# EAGLE design board_PMA (EAGLE 9.6.2)
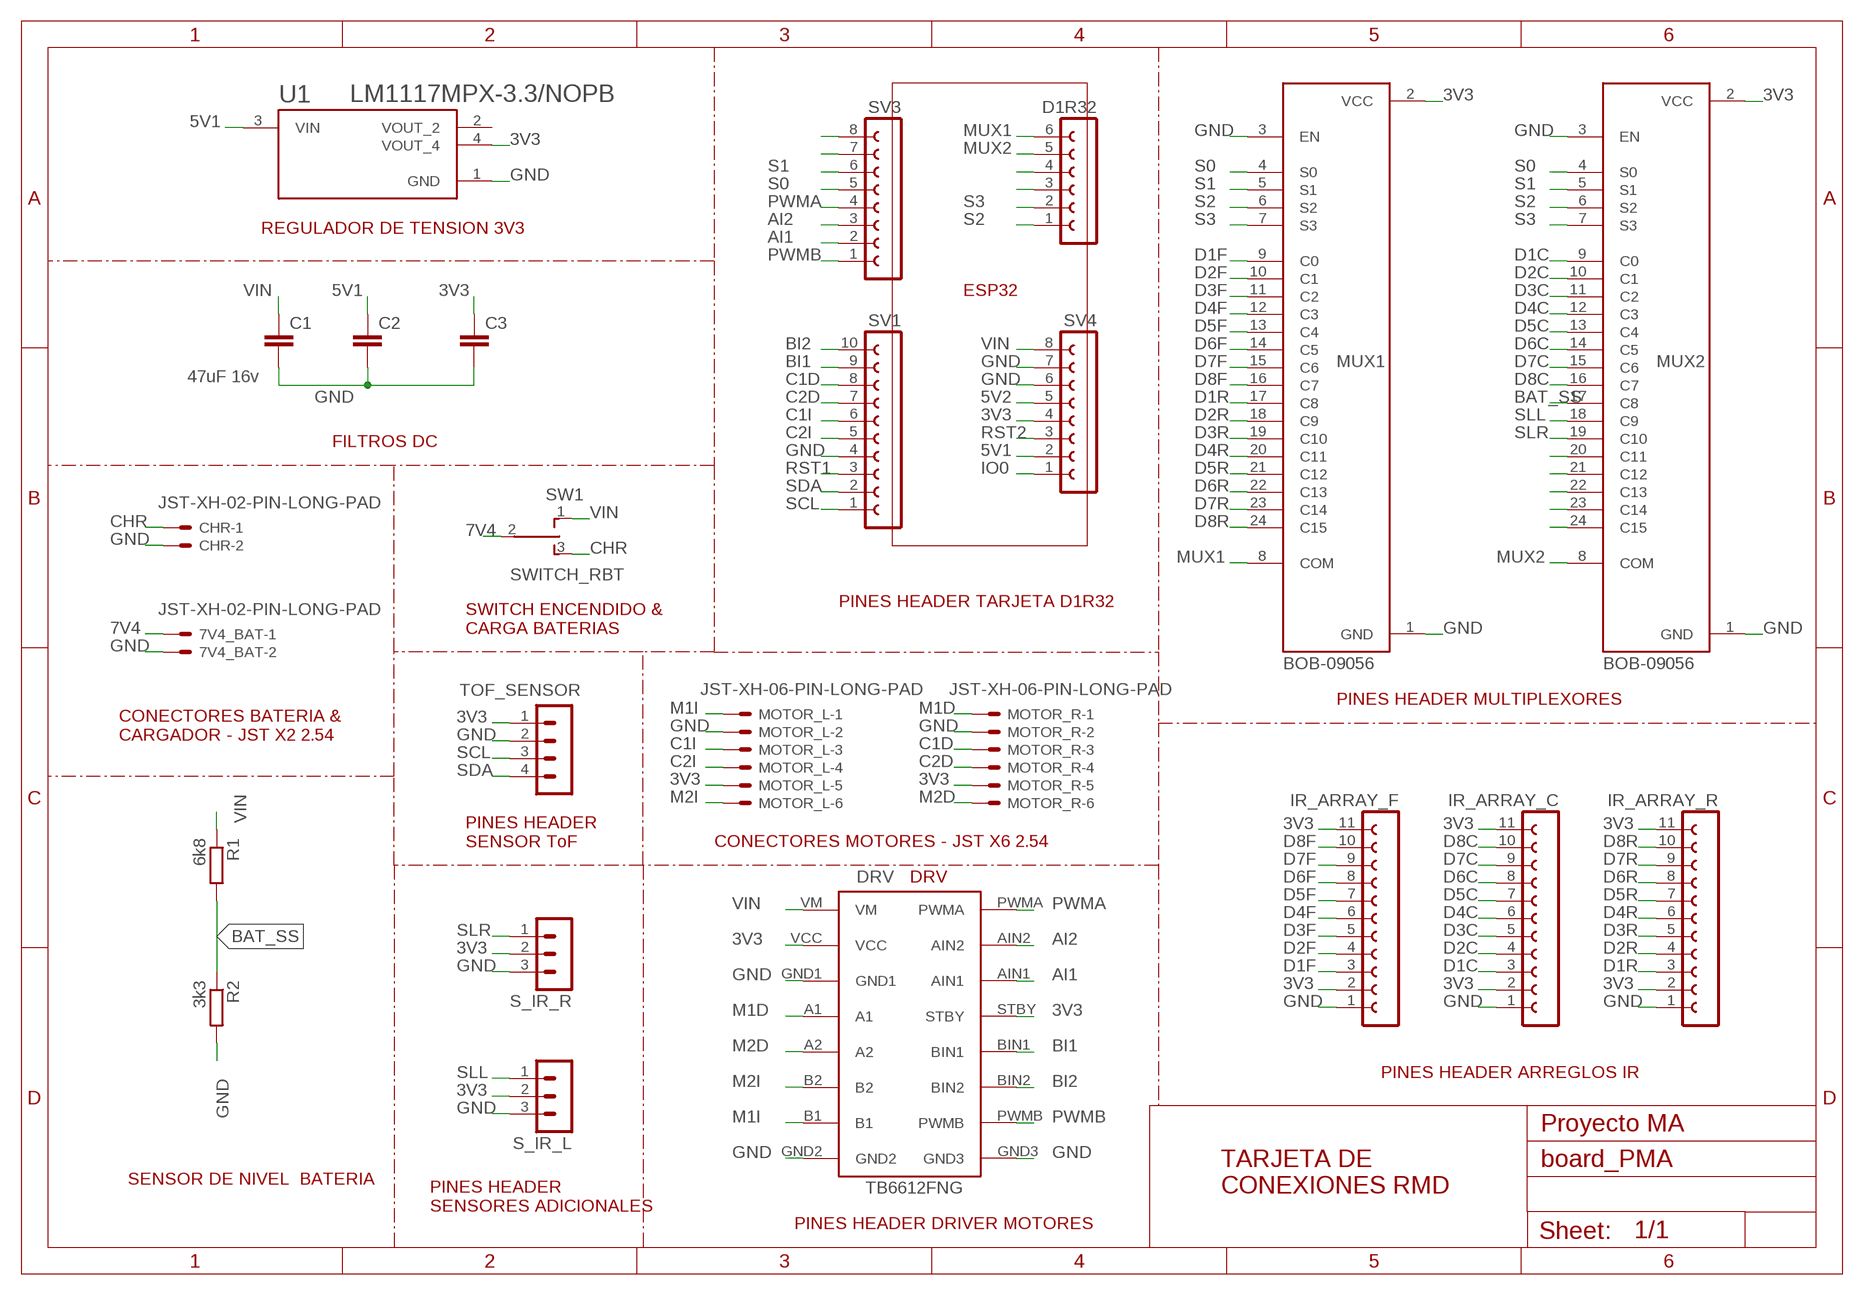
[diagram p0: schematic, sheet 1]

## Parts
7V4_BAT  JST-XH-02-PIN-LONG-PAD  [JST-XH-02-PACKAGE-LONG-PAD]
C1  47uF 16v  C-EUC1206K  [C1206K]
C2  C-EUC1206K  [C1206K]
C3  C-EUC1206K  [C1206K]
CHR  JST-XH-02-PIN-LONG-PAD  [JST-XH-02-PACKAGE-LONG-PAD]
D1R32  FE06-1  [FE06]
DRV  TB6612FNG  [TB6612FNG]
IR_ARRAY_C  FE11-1  [FE11]
IR_ARRAY_F  FE11-1  [FE11]
IR_ARRAY_R  FE11-1  [FE11]
MOTOR_L  JST-XH-06-PIN-LONG-PAD  [JST-XH-06-PACKAGE-LONG-PAD]
MOTOR_R  JST-XH-06-PIN-LONG-PAD  [JST-XH-06-PACKAGE-LONG-PAD]
MUX1  BOB-09056  [XDCR_BOB-09056]
MUX2  BOB-09056  [XDCR_BOB-09056]
R1  6k8  R-EU_0207/10  [0207/10]
R2  3k3  R-EU_0207/10  [0207/10]
S_IR_L  MA03-1  [MA03-1]
S_IR_R  MA03-1  [MA03-1]
SV1  FE10-1  [FE10]
SV3  FE08-1  [FE08]
SV4  FE08-1  [FE08]
SW1  SWITCH_RBT  [SW]
TOF_SENSOR  MA04-1  [MA04-1]
U1  LM1117MPX-3.3/NOPB  [VREG_LM1117MPX-3.3/NOPB]

## Nets
3V3: C3.1 DRV.STBY DRV.VCC IR_ARRAY_C.2 IR_ARRAY_C.11 IR_ARRAY_F.2 IR_ARRAY_F.11 IR_ARRAY_R.2 IR_ARRAY_R.11 MOTOR_L.5 MOTOR_R.5 MUX1.2(VCC) MUX2.2(VCC) S_IR_L.2 S_IR_R.2 SV4.4 TOF_SENSOR.1 U1.4(VOUT_4)
5V1: C2.1 SV4.2 U1.3(VIN)
5V2: SV4.5
7V4: 7V4_BAT.1 SW1.2
AI1: DRV.AIN1 SV3.2
AI2: DRV.AIN2 SV3.3
BAT_SS: MUX2.17(C8) R1.2 R2.1
BI1: DRV.BIN1 SV1.9
BI2: DRV.BIN2 SV1.10
C1D: MOTOR_R.3 SV1.8
C1I: MOTOR_L.3 SV1.6
C2D: MOTOR_R.4 SV1.7
C2I: MOTOR_L.4 SV1.5
CHR: CHR.1 SW1.3
D1C: IR_ARRAY_C.3 MUX2.9(C0)
D1F: IR_ARRAY_F.3 MUX1.9(C0)
D1R: IR_ARRAY_R.3 MUX1.17(C8)
D2C: IR_ARRAY_C.4 MUX2.10(C1)
D2F: IR_ARRAY_F.4 MUX1.10(C1)
D2R: IR_ARRAY_R.4 MUX1.18(C9)
D3C: IR_ARRAY_C.5 MUX2.11(C2)
D3F: IR_ARRAY_F.5 MUX1.11(C2)
D3R: IR_ARRAY_R.5 MUX1.19(C10)
D4C: IR_ARRAY_C.6 MUX2.12(C3)
D4F: IR_ARRAY_F.6 MUX1.12(C3)
D4R: IR_ARRAY_R.6 MUX1.20(C11)
D5C: IR_ARRAY_C.7 MUX2.13(C4)
D5F: IR_ARRAY_F.7 MUX1.13(C4)
D5R: IR_ARRAY_R.7 MUX1.21(C12)
D6C: IR_ARRAY_C.8 MUX2.14(C5)
D6F: IR_ARRAY_F.8 MUX1.14(C5)
D6R: IR_ARRAY_R.8 MUX1.22(C13)
D7C: IR_ARRAY_C.9 MUX2.15(C6)
D7F: IR_ARRAY_F.9 MUX1.15(C6)
D7R: IR_ARRAY_R.9 MUX1.23(C14)
D8C: IR_ARRAY_C.10 MUX2.16(C7)
D8F: IR_ARRAY_F.10 MUX1.16(C7)
D8R: IR_ARRAY_R.10 MUX1.24(C15)
GND: 7V4_BAT.2 C1.2 C2.2 C3.2 CHR.2 DRV.GND1 DRV.GND2 DRV.GND3 IR_ARRAY_C.1 IR_ARRAY_F.1 IR_ARRAY_R.1 MOTOR_L.2 MOTOR_R.2 MUX1.1(GND) MUX1.3(EN) MUX2.1(GND) MUX2.3(EN) R2.2 S_IR_L.3 S_IR_R.3 SV1.4 SV4.6 SV4.7 TOF_SENSOR.2 U1.1(GND)
IO0: SV4.1
M1D: DRV.A1 MOTOR_R.1
M1I: DRV.B1 MOTOR_L.1
M2D: DRV.A2 MOTOR_R.6
M2I: DRV.B2 MOTOR_L.6
MUX1: D1R32.6 MUX1.8(COM)
MUX2: D1R32.5 MUX2.8(COM)
N$1: D1R32.3
N$7: SV3.7
N$8: SV3.8
N$16: D1R32.4
N$32: MUX2.20(C11)
N$33: MUX2.21(C12)
N$34: MUX2.22(C13)
N$35: MUX2.23(C14)
N$36: MUX2.24(C15)
PWMA: DRV.PWMA SV3.4
PWMB: DRV.PWMB SV3.1
RST1: SV1.3
RST2: SV4.3
S0: MUX1.4(S0) MUX2.4(S0) SV3.5
S1: MUX1.5(S1) MUX2.5(S1) SV3.6
S2: D1R32.1 MUX1.6(S2) MUX2.6(S2)
S3: D1R32.2 MUX1.7(S3) MUX2.7(S3)
SCL: SV1.1 TOF_SENSOR.3
SDA: SV1.2 TOF_SENSOR.4
SLL: MUX2.18(C9) S_IR_L.1
SLR: MUX2.19(C10) S_IR_R.1
VIN: C1.1 DRV.VM R1.1 SV4.8 SW1.1
Unconnected: U1.2(VOUT_2)

## Notes on the sheet
- REGULADOR DE TENSION 3V3
- ESP32
- FILTROS DC
- PINES HEADER TARJETA D1R32
- SWITCH ENCENDIDO &
  CARGA BATERIAS
- PINES HEADER MULTIPLEXORES
- CONECTORES BATERIA &
  CARGADOR - JST X2 2.54
- PINES HEADER
  SENSOR ToF
- CONECTORES MOTORES - JST X6 2.54
- PINES HEADER ARREGLOS IR
- Proyecto MA
- SENSOR DE NIVEL  BATERIA
- TARJETA DE
  CONEXIONES RMD
- PINES HEADER
  SENSORES ADICIONALES
- PINES HEADER DRIVER MOTORES

## Library data of the parts
7V4_BAT CHR = plataformaEXP:JST-XH-02-PIN: JST XH Connector 2 Pin Wire to board connector. Pitch: 2,54 mm, (0.100") Number of pins: 2 Created by Rembrandt Electronics www.rembrandtelectronics.com
C1-C3 = plataformaEXP:C-EU: CAPACITOR, European symbol; SPICEPREFIX: C
D1R32 = plataformaEXP:FE06-1: FEMALE HEADER; OC_FARNELL: unknown; OC_NEWARK: unknown
DRV = plataformaEXP:TB6612FNG
IR_ARRAY_C IR_ARRAY_F IR_ARRAY_R = plataformaEXP:FE11-1: FEMALE HEADER; OC_FARNELL: unknown; OC_NEWARK: unknown
MOTOR_L MOTOR_R = plataformaEXP:JST-XH-06-PIN: JST XH Connector 2 Pin Wire to board connector. Pitch: 2,54 mm, (0.100") Number of pins: 6 Created by Rembrandt Electronics www.rembrandtelectronics.com
MUX1 MUX2 = plataformaEXP:BOB-09056: Switch Development Tools A/D MUX Breakout CD74HC4067 Check prices <https://pricing.snapeda.com/parts/BOB-09056/SparkFun%20Electronics/view-part?ref=eda>; AVAILABILITY: In Stock; DESCRIPTION: 74HC4067 Analog and Digital Switch Interface Evaluation Board; MF: SparkFun Electronics; MP: BOB-09056; PACKAGE: None; PRICE: None; PURCHASE-URL: https://pricing.snapeda.com/search/part/BOB-09056/?ref=eda
R1 R2 = plataformaEXP:R-EU_: RESISTOR, European symbol; SPICEPREFIX: R
S_IR_L S_IR_R = plataformaEXP:MA03-1: PIN HEADER; OC_FARNELL: unknown; OC_NEWARK: unknown
SV1 = plataformaEXP:FE10-1: FEMALE HEADER; OC_FARNELL: unknown; OC_NEWARK: unknown
SV3 SV4 = plataformaEXP:FE08-1: FEMALE HEADER; OC_FARNELL: unknown; OC_NEWARK: unknown
SW1 = plataformaEXP:SWITCH_RBT
TOF_SENSOR = plataformaEXP:MA04-1: PIN HEADER; OC_FARNELL: unknown; OC_NEWARK: unknown
U1 = plataformaEXP:LM1117MPX-3.3/NOPB: 800-mA 15-V linear voltage regulator 4-SOT-223 0 to 125 Check prices <https://pricing.snapeda.com/parts/LM1117MPX-3.3/NOPB/Texas%20Instruments/view-part?ref=eda>; AVAILABILITY: No availability data; DESCRIPTION: 800-mA 15-V linear voltage regulator 4-SOT-223 0 to 125; MF: Texas Instruments; MP: LM1117MPX-3.3/NOPB; PACKAGE: SOT-223-4 Texas Instruments; PRICE: None; PURCHASE-URL: https://pricing.snapeda.com/search/part/LM1117MPX-3.3/NOPB/?ref=eda

## Board
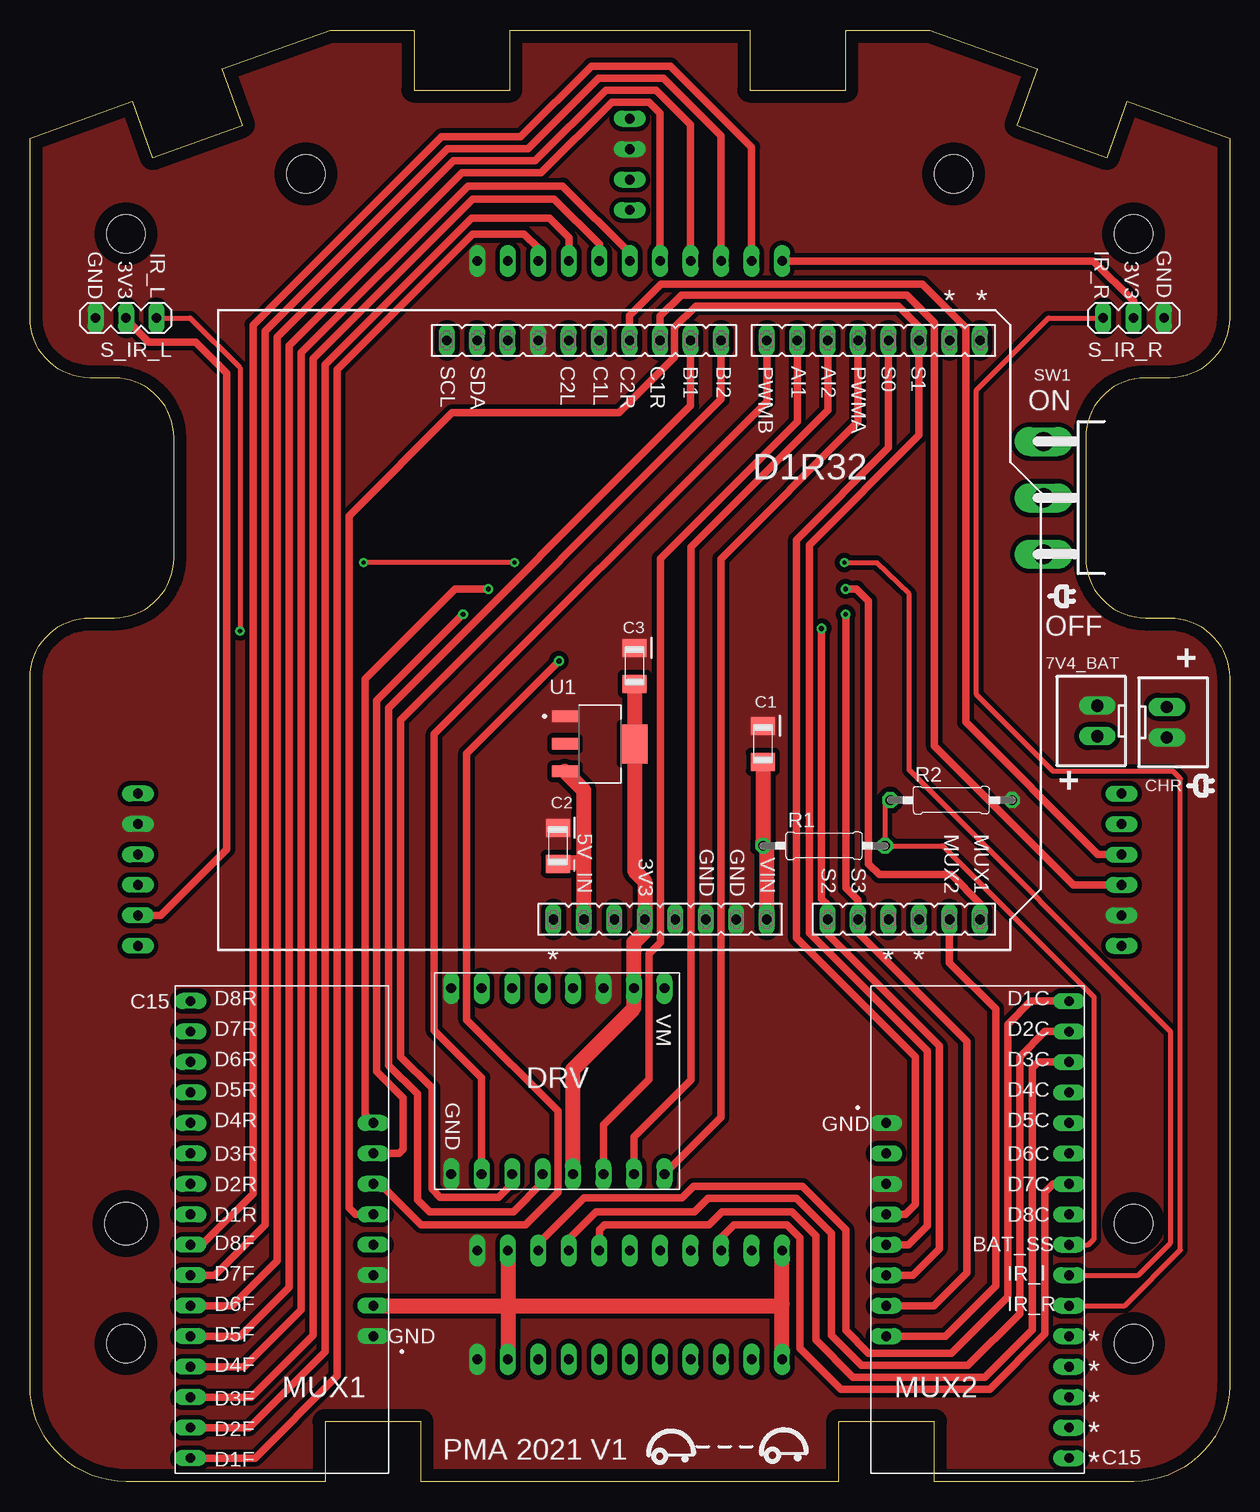
[diagram p1: board, top side]
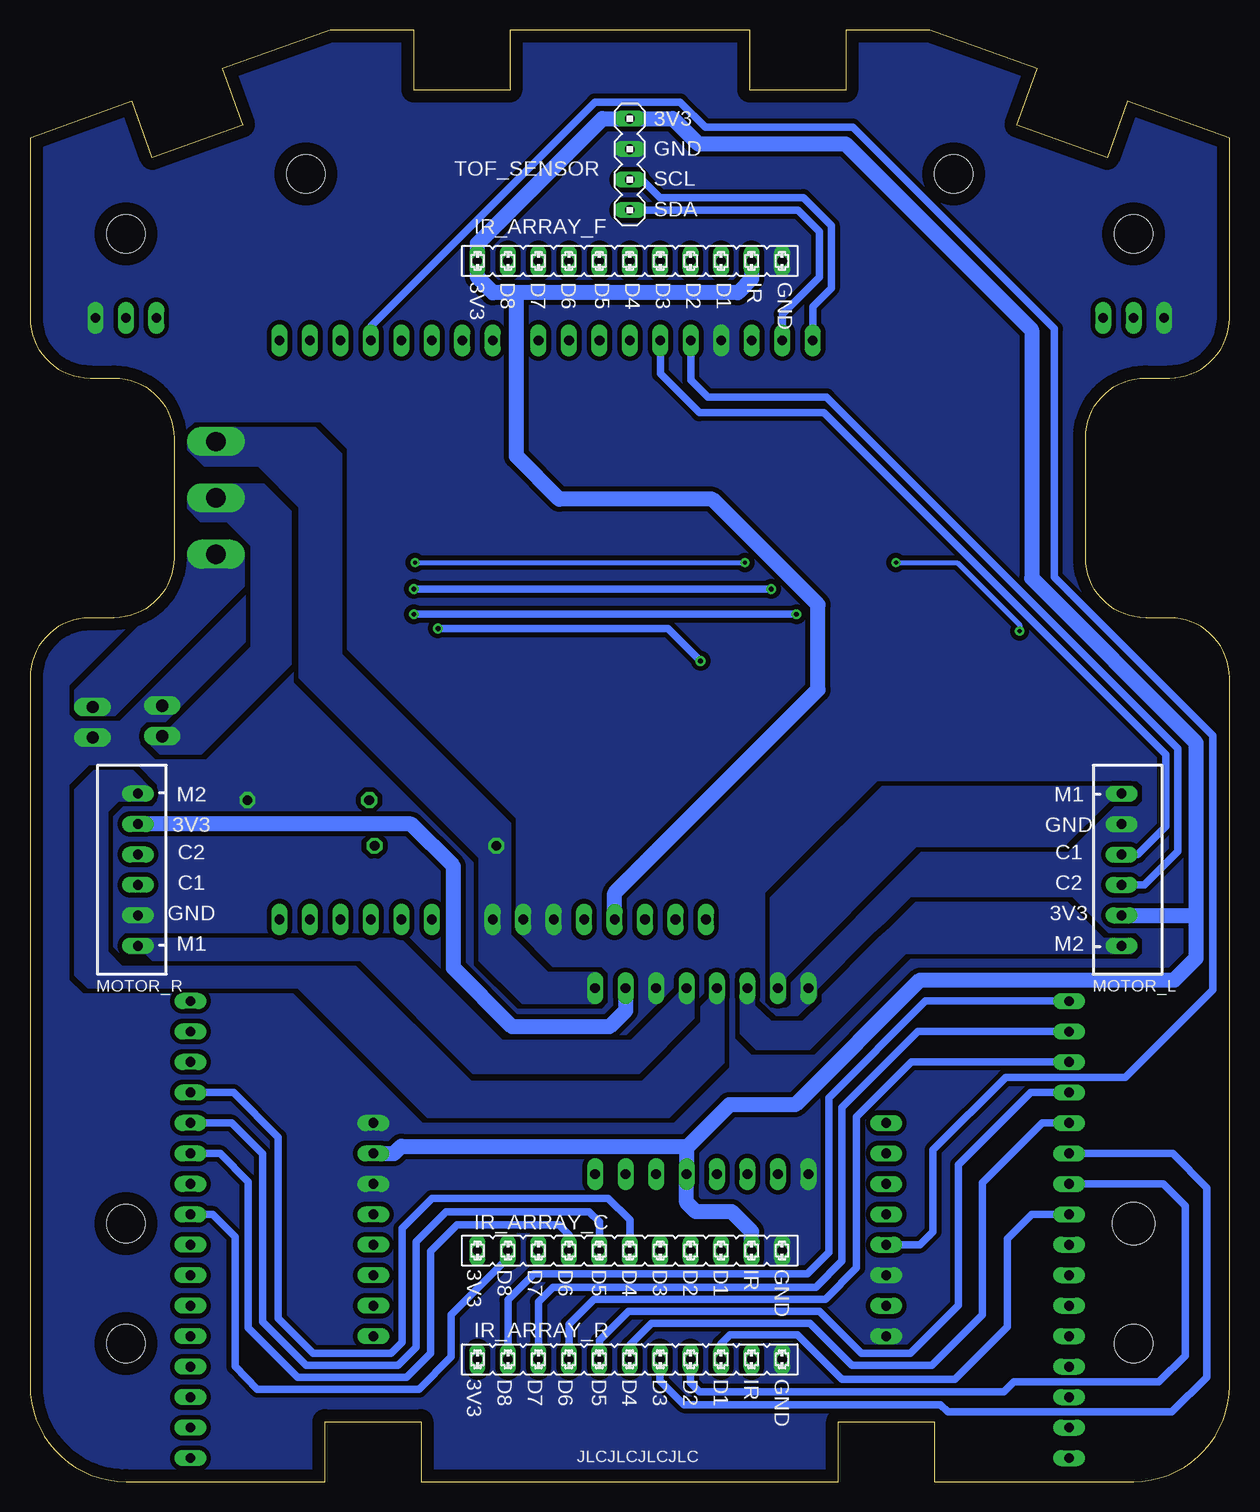
[diagram p2: board, bottom side, seen from below]

Size 100 x 121 mm. Coordinates in mm from the lower left corner, seen from the top.
Outline: 67.4,5 67.4,0 32.6,0 32.6,5 24.6,5 24.6,0 8,0 arc-90 0,8 0,67 arc-90 5,72 7,72 arc90 12,77 12,87 arc90 7,92 5,92 arc-90 0,97 0,112 8.51,115.06 10.2,110.36 17.73,113.07 16.04,117.77 25,121 32,121 32,116 40,116 40,121 50,121 60,121 60,116 68,116 68,121 75,121 83.97,117.77 82.27,113.07 89.8,110.36 91.49,115.06 100,112 100,97 arc-90 95,92 93,92 arc90 88,87 88,77 arc90 93,72 95,72 arc-90 100,67 100,8 arc-90 92,0 75.4,0 75.4,5 67.4,5
Copper layers (1*16): Top 0.035mm / dielectric 1.5mm / Bottom 0.035mm
Design rules "default": minimum track width 6mil, minimum drill 0.35mm, track to track 6mil, track to pad 6mil, pad to pad 6mil, via to via 6mil, smd to smd 6mil, copper to edge 40mil, drill to drill 6mil, minimum pad ring 10mil, minimum via ring 8mil, stop-mask expansion 4mil, vias tented up to drill 0mil, thermal gap 10mil
Holes 3.2 mm at 8,104 23,109 77,109 92,104 92,21.5 92,11.5 8,11.5
Holes 3.5 mm at 8,21.5

### Footprints (pad centres in the part's own frame; a part is rotated, then mirrored left to right if it is on the bottom)
JST-XH-02-PACKAGE-LONG-PAD = drill 1.016 long: 1 -1.27,0; 2 1.27,0
C1206K = smd 1.5 x 2: 1 -1.5,0; 2 1.5,0
FE06 = drill 0.813 long: 1 -6.35,0; 2 -3.81,0; 3 -1.27,0; 4 1.27,0; 5 3.81,0; 6 6.35,0
TB6612FNG = drill 0.813 long: A1 -7.62,1.27; A2 -7.62,-1.27; AIN1 7.874,3.81; AIN2 7.874,6.35; B1 -7.62,-6.35; B2 -7.62,-3.81; BIN1 7.874,-1.27; BIN2 7.874,-3.81; GND1 -7.62,3.81; GND2 -7.62,-8.89; GND3 7.874,-8.89; PWMA 7.874,8.89; PWMB 7.874,-6.35; STBY 7.874,1.27; VCC -7.62,6.35; VM -7.62,8.89
FE11 = drill 0.813 long: 1 -12.7,0; 2 -10.16,0; 3 -7.62,0; 4 -5.08,0; 5 -2.54,0; 6 0,0; 7 2.54,0; 8 5.08,0; 9 7.62,0; 10 10.16,0; 11 12.7,0
JST-XH-06-PACKAGE-LONG-PAD = drill 0.813 long: 1 -6.35,0; 2 -3.81,0; 3 -1.27,0; 4 1.27,0; 5 3.81,0; 6 6.35,0
XDCR_BOB-09056 = drill 0.813 long: 1 -7.62,8.89; 2 -7.62,6.35; 3 -7.62,3.81; 4 -7.62,1.27; 5 -7.62,-1.27; 6 -7.62,-3.81; 7 -7.62,-6.35; 8 -7.62,-8.89; 9 7.62,19.05; 10 7.62,16.51; 11 7.62,13.97; 12 7.62,11.43; 13 7.62,8.89; 14 7.62,6.35; 15 7.62,3.81; 16 7.62,1.27; 17 7.62,-1.27; 18 7.62,-3.81; 19 7.62,-6.35; 20 7.62,-8.89; 21 7.62,-11.43; 22 7.62,-13.97; 23 7.62,-16.51; 24 7.62,-19.05
0207/10 = drill 0.813 octagon: 1 -5.08,0; 2 5.08,0
MA03-1 = drill 0.813 long: 1 -2.54,0; 2 0,0; 3 2.54,0
FE10 = drill 0.813 long: 1 -11.43,0; 2 -8.89,0; 3 -6.35,0; 4 -3.81,0; 5 -1.27,0; 6 1.27,0; 7 3.81,0; 8 6.35,0; 9 8.89,0; 10 11.43,0
FE08 = drill 0.813 long: 1 -8.89,0; 2 -6.35,0; 3 -3.81,0; 4 -1.27,0; 5 1.27,0; 6 3.81,0; 7 6.35,0; 8 8.89,0
SW = drill 1.6 long: 1 -4.7,0; 2 0,0; 3 4.7,0
MA04-1 = drill 0.813 long: 1 -3.81,0; 2 -1.27,0; 3 1.27,0; 4 3.81,0
VREG_LM1117MPX-3.3/NOPB = smd 2.15 x 0.95: 1 -2.9,2.3; 2 -2.9,0; 3 -2.9,-2.3 | smd 2.15 x 3.25: 4 2.9,0

### Placement (x,y rotation side)
7V4_BAT  88.98,63.4 90 top
C1  61.1,61.5 90 top
C2  44,53 90 top
C3  50.4,68 90 top
CHR  94.78,63.3 270 top
D1R32  72.85,46.86 0 top
DRV  44,33.5 270 top
IR_ARRAY_C  50,19.25 0 top
IR_ARRAY_F  50,101.75 0 top
IR_ARRAY_R  50,10.18 0 top
MOTOR_L  9,51 270 bottom
MOTOR_R  91,51 90 bottom
MUX1  21,21 180 top
MUX2  79,21 0 top
R1  66.2,53 0 top
R2  76.8,56.8 0 top
S_IR_L  8,97 180 top
S_IR_R  92,97 0 top
SV1  46.18,95.12 0 top
SV3  70.31,95.12 0 top
SV4  52.53,46.86 0 top
SW1  84.5,82 270 top
TOF_SENSOR  50,109.8 270 top
U1  47.5,61.5 0 top

### Tracks (layer width: path | path; a pad name or v marks a point on that pad's centre or on a via)
3V3
  Top 0.61: MOTOR_L.5 10.89,47.19 16.4,52.7 16.4,92.4 13.8,95 9.9,95 8,96.9 S_IR_L.2 | IR_ARRAY_F.11 88.65,101.75 92,98.4 S_IR_R.2
  Top 1.27: IR_ARRAY_R.11 62.7,14.8 | 62.7,14.8 IR_ARRAY_C.11 | IR_ARRAY_C.2 39.84,14.6 | 39.84,14.6 IR_ARRAY_R.2 | MUX1.2 39.79,14.65 | 39.79,14.65 39.84,14.6 | 39.79,14.65 62.55,14.65 62.7,14.8 | C3.1 U1.4 50.4,50.9 51.26,50.04 SV4.4 51.26,45.86 50.35,44.95 DRV.VCC 50.35,39.45 45.27,34.37 DRV.STBY
  Bottom 1.27: IR_ARRAY_C.2 39.84,20.84 41.5,22.5 44.5,22.5 45.27,23.27 DRV.STBY 45.27,27.83 | 70.8,27.35 MUX2.2 69.65,27.35 69.05,27.95 45.27,27.95 45.27,27.83 | IR_ARRAY_F.2 39.84,100.26 41,99.1 59.46,99.1 | 59.46,99.1 61.4,99.1 62.7,100.4 IR_ARRAY_F.11 62.7,103.2 52.29,113.61 TOF_SENSOR.1 46.4,113.61 44.3,111.51 32.01,111.51 16.5,96 16.5,75.3 2.8,61.6 2.8,46.9 | 45.27,27.83 41.7,31.4 36.2,31.4 25.8,41.8 4.6,41.8 2.8,43.6 2.8,46.9 | MOTOR_L.5 3.09,47.19 2.8,46.9 | DRV.VCC 50.35,39.25 51.7,37.9 59.8,37.9 64.7,42.8 64.7,51.3 68.21,54.81 MOTOR_R.5 | 59.46,99.1 59.46,85.46 55.89,81.89 43.11,81.89 34.31,73.09 34.31,66.01 51.26,49.06 SV4.4
5V1
  Top 1.27: SV4.2 46.18,51.6 | 46.18,51.6 46.18,57.62 U1.3 | C2.1 44.1,51.6 46.18,51.6
7V4
  pour Bottom (no thermals): 85.9,83.2 80.5,83.2 78.2,80.9 78.2,68.1 85.7,60.6 89.2,60.6 90.4,61.8 90.4,62.4 89.9,62.9 88.3,62.9 81.6,69.6 81.6,78 83.6,80 85.8,80 86.9,81.1 86.9,82.2
AI1
  Top 0.61: SV3.2 63.96,88.36 52.55,76.95 52.55,44.95 51.6,44 51.6,42.8 51.61,42.79 51.61,33.53 47.81,29.73 DRV.AIN1
AI2
  Top 0.61: DRV.AIN2 50.35,28.75 55.1,33.5 55.1,77.9 66.5,89.3 SV3.3
BAT_SS
  Top 0.406: MUX2.17 88.23,19.73 88.7,20.2 88.7,40.4 76.1,53 R1.2 71.28,56.36 R2.1
BI1
  Top 0.61: DRV.BIN1 42.73,24.93 40.3,22.5 33.3,22.5 32.3,23.5 32.3,32.3 29.9,34.7 29.9,64.5 55.07,89.67 SV1.9
BI2
  Top 0.61: DRV.BIN2 40.19,24.83 39.06,23.7 34.2,23.7 33.5,24.4 33.5,32.8 30.9,35.4 30.9,63.5 57.61,90.21 SV1.10
C1D
  Top 0.61: MOTOR_R.3 86.97,49.73 75.4,61.3 75.4,96.6 73.1,98.9 54.3,98.9 52.53,97.13 SV1.8
C1I
  Bottom 0.61: MOTOR_L.3 7.63,52.27 5.3,54.6 5.3,60.6 33.8,89.1 44.2,89.1 47.45,92.35 SV1.6
C2D
  Top 0.61: MOTOR_R.4 89.03,52.27 78,63.3 78,96.2 74.4,99.8 52.6,99.8 49.99,97.19 SV1.7
C2I
  Bottom 0.61: MOTOR_L.4 7.1,49.73 4.3,52.53 4.3,61.1 33.6,90.4 43.5,90.4 44.91,91.81 SV1.5
CHR
  pour Bottom (no thermals): 82.1,77.5 82.1,74.6 92.9,63.8 95.8,63.8 96.3,64.3 96.3,66 87.3,75 87.3,77.2 86,78.5 83.1,78.5
D1C
  Top 0.61: IR_ARRAY_C.3 42.38,19.85 46.18,23.65 54.35,23.65 55.3,24.6 64.4,24.6 68,21 68,12.6 69.9,10.7 76.8,10.7 81.5,15.4 81.5,38.1 83.45,40.05 MUX2.9
D1F
  Top 0.61: MUX1.9 18.75,1.95 25.6,8.8 25.6,92.7 36.9,104 41.2,104 42.38,102.82 IR_ARRAY_F.3
D1R
  Bottom 0.61: MUX1.17 16.48,22.27 18.54,20.21 18.54,12.88 22.88,8.54 32.32,8.54 36.02,12.24 41.66,12.24 42.4,11.5 42.4,10.2 IR_ARRAY_R.3
D2C
  Top 0.61: MUX2.10 84.61,37.51 82.5,35.4 82.5,14 78.2,9.7 69.3,9.7 66.8,12.2 66.8,20.7 63.9,23.6 56.5,23.6 55.4,22.5 47.2,22.5 44.92,20.22 IR_ARRAY_C.4
D2F
  Top 0.61: IR_ARRAY_F.4 44.92,103.68 43.3,105.3 36.8,105.3 24.6,93.1 24.6,10.8 18.29,4.49 MUX1.10
D2R
  Bottom 0.61: IR_ARRAY_R.4 44.92,8.22 44.2,7.5 18.8,7.5 18,8.3 5.9,8.3 3.7,10.5 3.7,23 5.51,24.81 MUX1.18
D3C
  Top 0.61: IR_ARRAY_C.5 47.46,20.96 47.9,21.4 56.6,21.4 57.7,22.5 63.5,22.5 65.5,20.5 65.5,11.8 68.6,8.7 79.6,8.7 83.56,12.66 83.56,34.46 84.07,34.97 MUX2.11
D3F
  Top 0.61: IR_ARRAY_F.5 47.46,103.14 43.7,106.9 36.9,106.9 23.6,93.6 23.6,12.2 18.43,7.03 MUX1.11
D3R
  Bottom 0.61: IR_ARRAY_R.5 47.46,8.38 45.48,6.4 24.1,6.4 23.5,5.8 4.8,5.8 1.9,8.7 1.9,24.5 4.75,27.35 MUX1.19
D4C
  Bottom 0.61: MUX2.12 83.03,32.43 79.3,28.7 79.3,13.6 76.4,10.7 69.9,10.7 69,11.6 69,21.1 66.5,23.6 51.8,23.6 50,21.8 IR_ARRAY_C.6
D4F
  Top 0.61: IR_ARRAY_F.6 50,102.4 44.4,108 36.5,108 22.6,94.1 22.6,14.3 17.87,9.57 MUX1.12
D4R
  Bottom 0.61: MUX1.20 15.61,29.89 20.6,24.9 20.6,13.9 24.8,9.7 31.5,9.7 35,13.2 48.2,13.2 50,11.4 IR_ARRAY_R.6
D5C
  Bottom 0.61: IR_ARRAY_C.7 52.54,21.64 53.4,22.5 65.3,22.5 67.8,20 67.8,11.2 69.3,9.7 77,9.7 80.6,13.3 80.6,27.3 83.19,29.89 MUX2.13
D5F
  Top 0.61: IR_ARRAY_F.7 52.54,114.06 51.6,115 48.5,115 42.6,109.1 36,109.1 21.6,94.7 21.6,16.2 17.51,12.11 MUX1.13
D5R
  Bottom 0.61: MUX1.21 16.57,32.43 22.6,26.4 22.6,14.7 26.6,10.7 30.7,10.7 34.2,14.2 50.1,14.2 52.54,11.76 IR_ARRAY_R.7
D6C
  Bottom 0.61: IR_ARRAY_C.8 55.08,20.58 55.9,21.4 64.4,21.4 66.6,19.2 66.6,10.7 68.6,8.7 77.7,8.7 81.8,12.8 81.8,25 84.15,27.35 MUX2.14
D6F
  Top 0.61: IR_ARRAY_F.8 55.08,113.12 52.2,116 48,116 42.1,110.1 35.3,110.1 20.6,95.4 20.6,18.4 16.85,14.65 MUX1.14
D6R
  Bottom 0.61: IR_ARRAY_R.8 55.08,13.12 53,15.2 33.7,15.2 31.1,17.8 31.1,30.4 26.53,34.97 MUX1.22
D7C
  Top 0.61: MUX2.15 85.31,24.81 84.6,24.1 84.6,12.3 80,7.7 67.6,7.7 64.2,11.1 64.2,20.3 63.1,21.4 58.7,21.4 57.62,20.32 IR_ARRAY_C.9
D7F
  Top 0.61: IR_ARRAY_F.9 57.62,112.18 52.8,117 47.4,117 41.5,111.1 34.8,111.1 19.6,95.9 19.6,21.4 15.39,17.19 MUX1.15
D7R
  Bottom 0.61: IR_ARRAY_R.9 57.62,14.98 56.4,16.2 34.5,16.2 32.3,18.4 32.3,31.2 25.99,37.51 MUX1.23
D8C
  Bottom 0.61: IR_ARRAY_C.10 60.16,18.64 64.9,13.9 64.9,10.4 67.56,7.7 81.04,7.7 82.9,9.6 82.9,20.4 84.77,22.27 MUX2.16
D8F
  Top 0.61: IR_ARRAY_F.10 60.16,111.24 53.4,118 46.8,118 40.9,112.1 34.3,112.1 18.6,96.4 18.6,24 14.33,19.73 MUX1.16
D8R
  Bottom 0.61: IR_ARRAY_R.10 60.16,15.14 58,17.3 35.2,17.3 33.4,19.1 33.4,32 25.35,40.05 MUX1.24
GND
  pour Top (isolate 0.406, rank 2, no thermals): 0,67 0,8 arc90 8,0 24.6,0 24.6,5 32.6,5 32.6,0 67.4,0 67.4,5 75.4,5 75.4,0 92,0 arc90 100,8 100,67 arc90 95,72 93,72 arc-90 88,77 88,87 arc-90 93,92 95,92 arc90 100,97 100,112 91.49,115.06 89.8,110.36 82.27,113.07 83.97,117.77 75,121 68,121 68,116 60,116 60,121 50,121 40,121 40,116 32,116 32,121 25,121 16.03,117.77 17.73,113.07 10.2,110.36 8.51,115.06 0,112 0,97 arc90 5,92 7,92 arc-90 12,87 12,77 arc-90 7,72 5,72 arc90
  pour Bottom (isolate 0.406, rank 2, no thermals): 8,0 arc-90 0,8 0,67 arc-90 5,72 7,72 arc90 12,77 12,87 arc90 7,92 5,92 arc-90 0,97 0,112 8.51,115.06 10.2,110.36 17.73,113.07 16.03,117.77 25,121 32,121 32,116 40,116 40,121 50,121 60,121 60,116 68,116 68,121 75,121 83.97,117.77 82.27,113.07 89.8,110.36 91.49,115.06 100,112 100,97 arc-90 95,92 93,92 arc90 88,87 88,77 arc90 93,72 95,72 arc-90 100,67 100,8 arc-90 92,0 75.4,0 75.4,5 67.4,5 67.4,0 32.6,0 32.6,5 24.6,5 24.6,0
M1D
  pour Bottom (isolate 0.406, no thermals): 44.6,41.8 44.6,38.6 49.2,34 63.1,34 72.5,43.4 89.8,43.4 90.4,44 91.8,44 92.1,44.3 92.1,44.9 91.7,45.3 69.1,45.3 60.6,36.8 49.9,36.8 45.9,40.8 45.9,41.8 45.5,42.2 45,42.2
M1I
  pour Bottom (isolate 0.406, no thermals): 7.7,57.4 7.7,57.6 8.1,58 29,58 35.6,51.4 38.3,48.7 38.3,41.1 38.3,40.3 37.9,39.9 37.3,39.9 37.2,40 37,40.2 37,42 26.1,52.9 21,52.9 13.8,52.9 10,56.7 8.1,56.7 7.7,57.1
M2D
  pour Bottom (no thermals): 42.1,41.9 42.1,34.9 46.7,30.3 66.9,30.3 77.7,41.1 95.2,41.1 96.3,42.2 96.3,57.7 94.7,59.3 91.4,59.3 89.8,57.7 89.8,57.1 90.2,56.7 92.6,56.7 93.5,55.8 93.5,44.2 92.3,43 72.8,43 63.2,33.4 49,33.4 44.1,38.3 44.1,39.6 43.4,40.3 43.4,41.9 43,42.3 42.5,42.3
M2I
  pour Bottom (isolate 0.406, no thermals): 7.7,44.4 7.7,44.8 8.2,45.3 10.5,45.3 13.5,48.3 26.2,48.3 28.3,46.2 29.3,45.3 34,40.6 34,40 35.6,38.4 38.2,38.4 39.55,39.7 39.55,41.9 40,42.4 40.4,42.4 40.8,42 40.8,37.3 39.5,36 35,36 27,44 8.1,44
MUX1  (via drill 0.4)
  Top 0.61: MUX1.8 27.92,30.59 27.92,66.9 35.42,74.4 v38.2,74.4 | D1R32.6 79.2,48.2 76.8,50.6 70.8,50.6 69.9,51.5 69.9,73.4 68.9,74.4 v68,74.4
  Bottom 0.61: v68,74.4 v38.2,74.4
MUX2
  Top 0.61: MUX2.8 76.31,12.11 80.5,16.3 80.5,39.4 76.66,43.24 D1R32.5
PWMA
  Top 0.61: DRV.PWMA 57.6,30.34 57.6,76.9 69.04,88.34 SV3.4
PWMB
  Top 0.61: DRV.PWMB 37.65,33.65 33.7,37.6 33.7,62.3 61.42,90.02 SV3.1
S0
  Top 0.61: SV3.5 71.58,86.18 63.9,78.5 63.9,45.3 73.8,35.4 73.8,23.1 72.97,22.27 MUX2.4
  Bottom 0.61: MUX1.4 25.82,19.73 24.72,20.83 24.72,27.63 18.65,33.7 8.7,33.7 1.4,41 1.4,62.2 14.6,75.4 14.6,96.1 31.4,112.9 43.7,112.9 45.8,115 52.9,115 71.58,96.32 SV3.5
S1
  Top 0.61: MUX2.5 73.23,19.73 74.8,21.3 74.8,35.9 64.98,45.72 64.98,78.08 74.12,87.22 SV3.6 74.12,96.28 72.4,98 55.5,98 53.75,96.25 53.75,93.75 49.1,89.1 35.2,89.1 26.6,80.5 26.6,22.8 27.13,22.27 MUX1.5
S2  (via drill 0.4)
  Top 0.61: MUX2.6 73.59,17.19 75.8,19.4 75.8,36.3 66.5,45.6 D1R32.1 66.5,48.06 66,48.56 v65.99,71.11 | MUX1.6 29.19,24.81 32.6,21.4 41.3,21.4 44,24.1 44,30.9 36.4,38.5 36.4,60.7 v44.1,68.4 | v65.99,71.11
  Bottom 0.61: v65.99,71.11 v65.98,71.1 46.8,71.1 v44.1,68.4
S3  (via drill 0.4)
  Top 0.61: MUX2.7 75.35,14.65 78.1,17.4 78.1,36.7 69.04,45.76 D1R32.2 69.04,48.46 68.04,49.46 68.04,72.26 v68,72.3 | MUX1.7 30.75,27.35 31.1,27.7 31.1,32 28.9,34.2 28.9,65.1 v36.1,72.3
  Bottom 0.61: v68,72.3 v36.1,72.3
SCL
  Bottom 0.61: TOF_SENSOR.3 49,108.53 47.5,107.03 35.53,107.03 33.2,104.7 33.2,99.5 34.75,97.95 SV1.1
SDA
  Bottom 0.61: TOF_SENSOR.4 35.99,105.99 34.2,104.2 34.2,100.4 37.29,97.31 SV1.2
SLL  (via drill 0.35)
  Top 0.406: v67.9,76.6 70.57,76.6 73.3,73.97 73.3,59.3 95.1,37.5 95.1,19.9 92.39,17.19 MUX2.18 | v40.4,76.6 v27.8,76.6 | v17.5,70.9 17.5,92.84 13.34,97 S_IR_L.1
  Bottom 0.406: v67.9,76.6 v40.4,76.6 | v27.8,76.6 22.7,76.6 17.5,71.4 v17.5,70.9
SLR
  Top 0.406: S_IR_R.1 84.9,97 78.9,91 78.9,65.6 85.3,59.2 95.3,59.2 95.9,58.6 95.9,19.3 91.25,14.65 MUX2.19
VIN
  Top 1.27: C1.1 61.1,53.31 | 61.1,53.31 R1.1 | SV4.8 61.42,52.76 61.1,53.08 61.1,53.31
  pour Bottom (no thermals): 81,84.6 85.5,84.6 86.9,86 86.9,86.9 85.9,87.9 76.2,87.9 74,85.7 74,69 59.9,54.9 59.9,45.6 56.8,42.5 52.74,42.5 52.25,42 52.25,40.32 52.68,39.8 59,39.8 62.6,43.4 62.6,52 77.6,67 77.6,81.2

### Text on the board
tPlace: GND | 3V3 | IR_L | IR_R | 3V3 | GND | * | * | SCL | SDA | C2L | C1L | C2R | C1R | BI1 | BI2 | PWMB | AI1 | AI2 | PWMA | S0 | S1 | ON | OFF | 5V_IN | 3V3 | GND | GND | VIN | S2 | S3 | MUX2 | MUX1 | * | * | * | D8R | D1C | C15 | VM | D7R | D2C | D6R | D3C | D5R | D4C | D4R | GND | D5C | GND | D3R | D6C | D2R | D7C | D1R | D8C | D8F | BAT_SS | D7F | IR_l | D6F | IR_R | D5F | GND | * | D4F | * | D3F | * | D2F | * | D1F | * | C15
bPlace: GND | IR | D1 | D2 | D3 | D4 | D5 | D6 | D7 | D8 | 3V3 | M1 | M2 | GND | 3V3 | C1 | C2 | C2 | C1 | 3V3 | GND | M2 | M1 | GND | IR | D1 | D2 | D3 | D4 | D5 | D6 | D7 | D8 | 3V3 | GND | IR | D1 | D2 | D3 | D4 | D5 | D6 | D7 | D8 | 3V3 | JLCJLCJLCJLC
tNames: + | + | PMA 2021 V1
bNames: 3V3 | GND | SCL | SDA